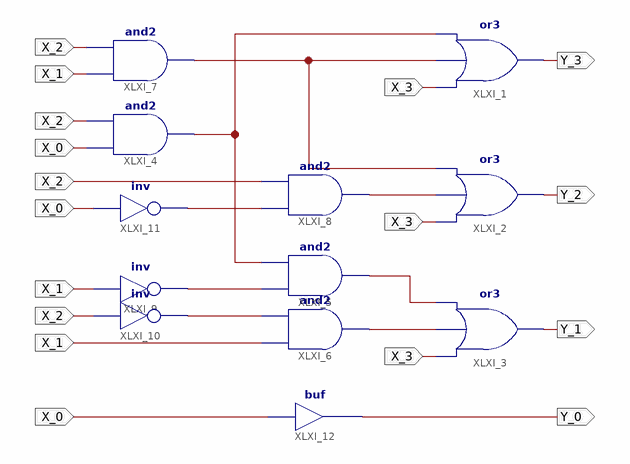
[diagram p0: schematic sheet 1]
// Xilinx ISE schematic NKB_to_Aiken_schematic.sch (kintex7) as structural Verilog: 12 symbols, 8 ports
module NKB_to_Aiken_schematic (
  input  X_3,
  input  X_1,
  input  X_2,
  input  X_0,
  output Y_1,
  output Y_2,
  output Y_3,
  output Y_0
);

  wire XLXN_1, XLXN_2, XLXN_3, XLXN_4, XLXN_5, XLXN_12, XLXN_15, XLXN_16;

  or XLXI_1 (Y_3, X_3, XLXN_1, XLXN_2);
  or XLXI_2 (Y_2, X_3, XLXN_5, XLXN_1);
  or XLXI_3 (Y_1, X_3, XLXN_4, XLXN_3);
  and XLXI_4 (XLXN_2, X_0, X_2);
  and XLXI_5 (XLXN_3, XLXN_15, XLXN_2);
  and XLXI_6 (XLXN_4, X_1, XLXN_16);
  and XLXI_7 (XLXN_1, X_1, X_2);
  and XLXI_8 (XLXN_5, XLXN_12, X_2);
  not XLXI_9 (XLXN_15, X_1);
  not XLXI_10 (XLXN_16, X_2);
  not XLXI_11 (XLXN_12, X_0);
  buf XLXI_12 (Y_0, X_0);
endmodule
